# Altium schematic sheet Группа 2.SchDoc
size 420 x 297 mm
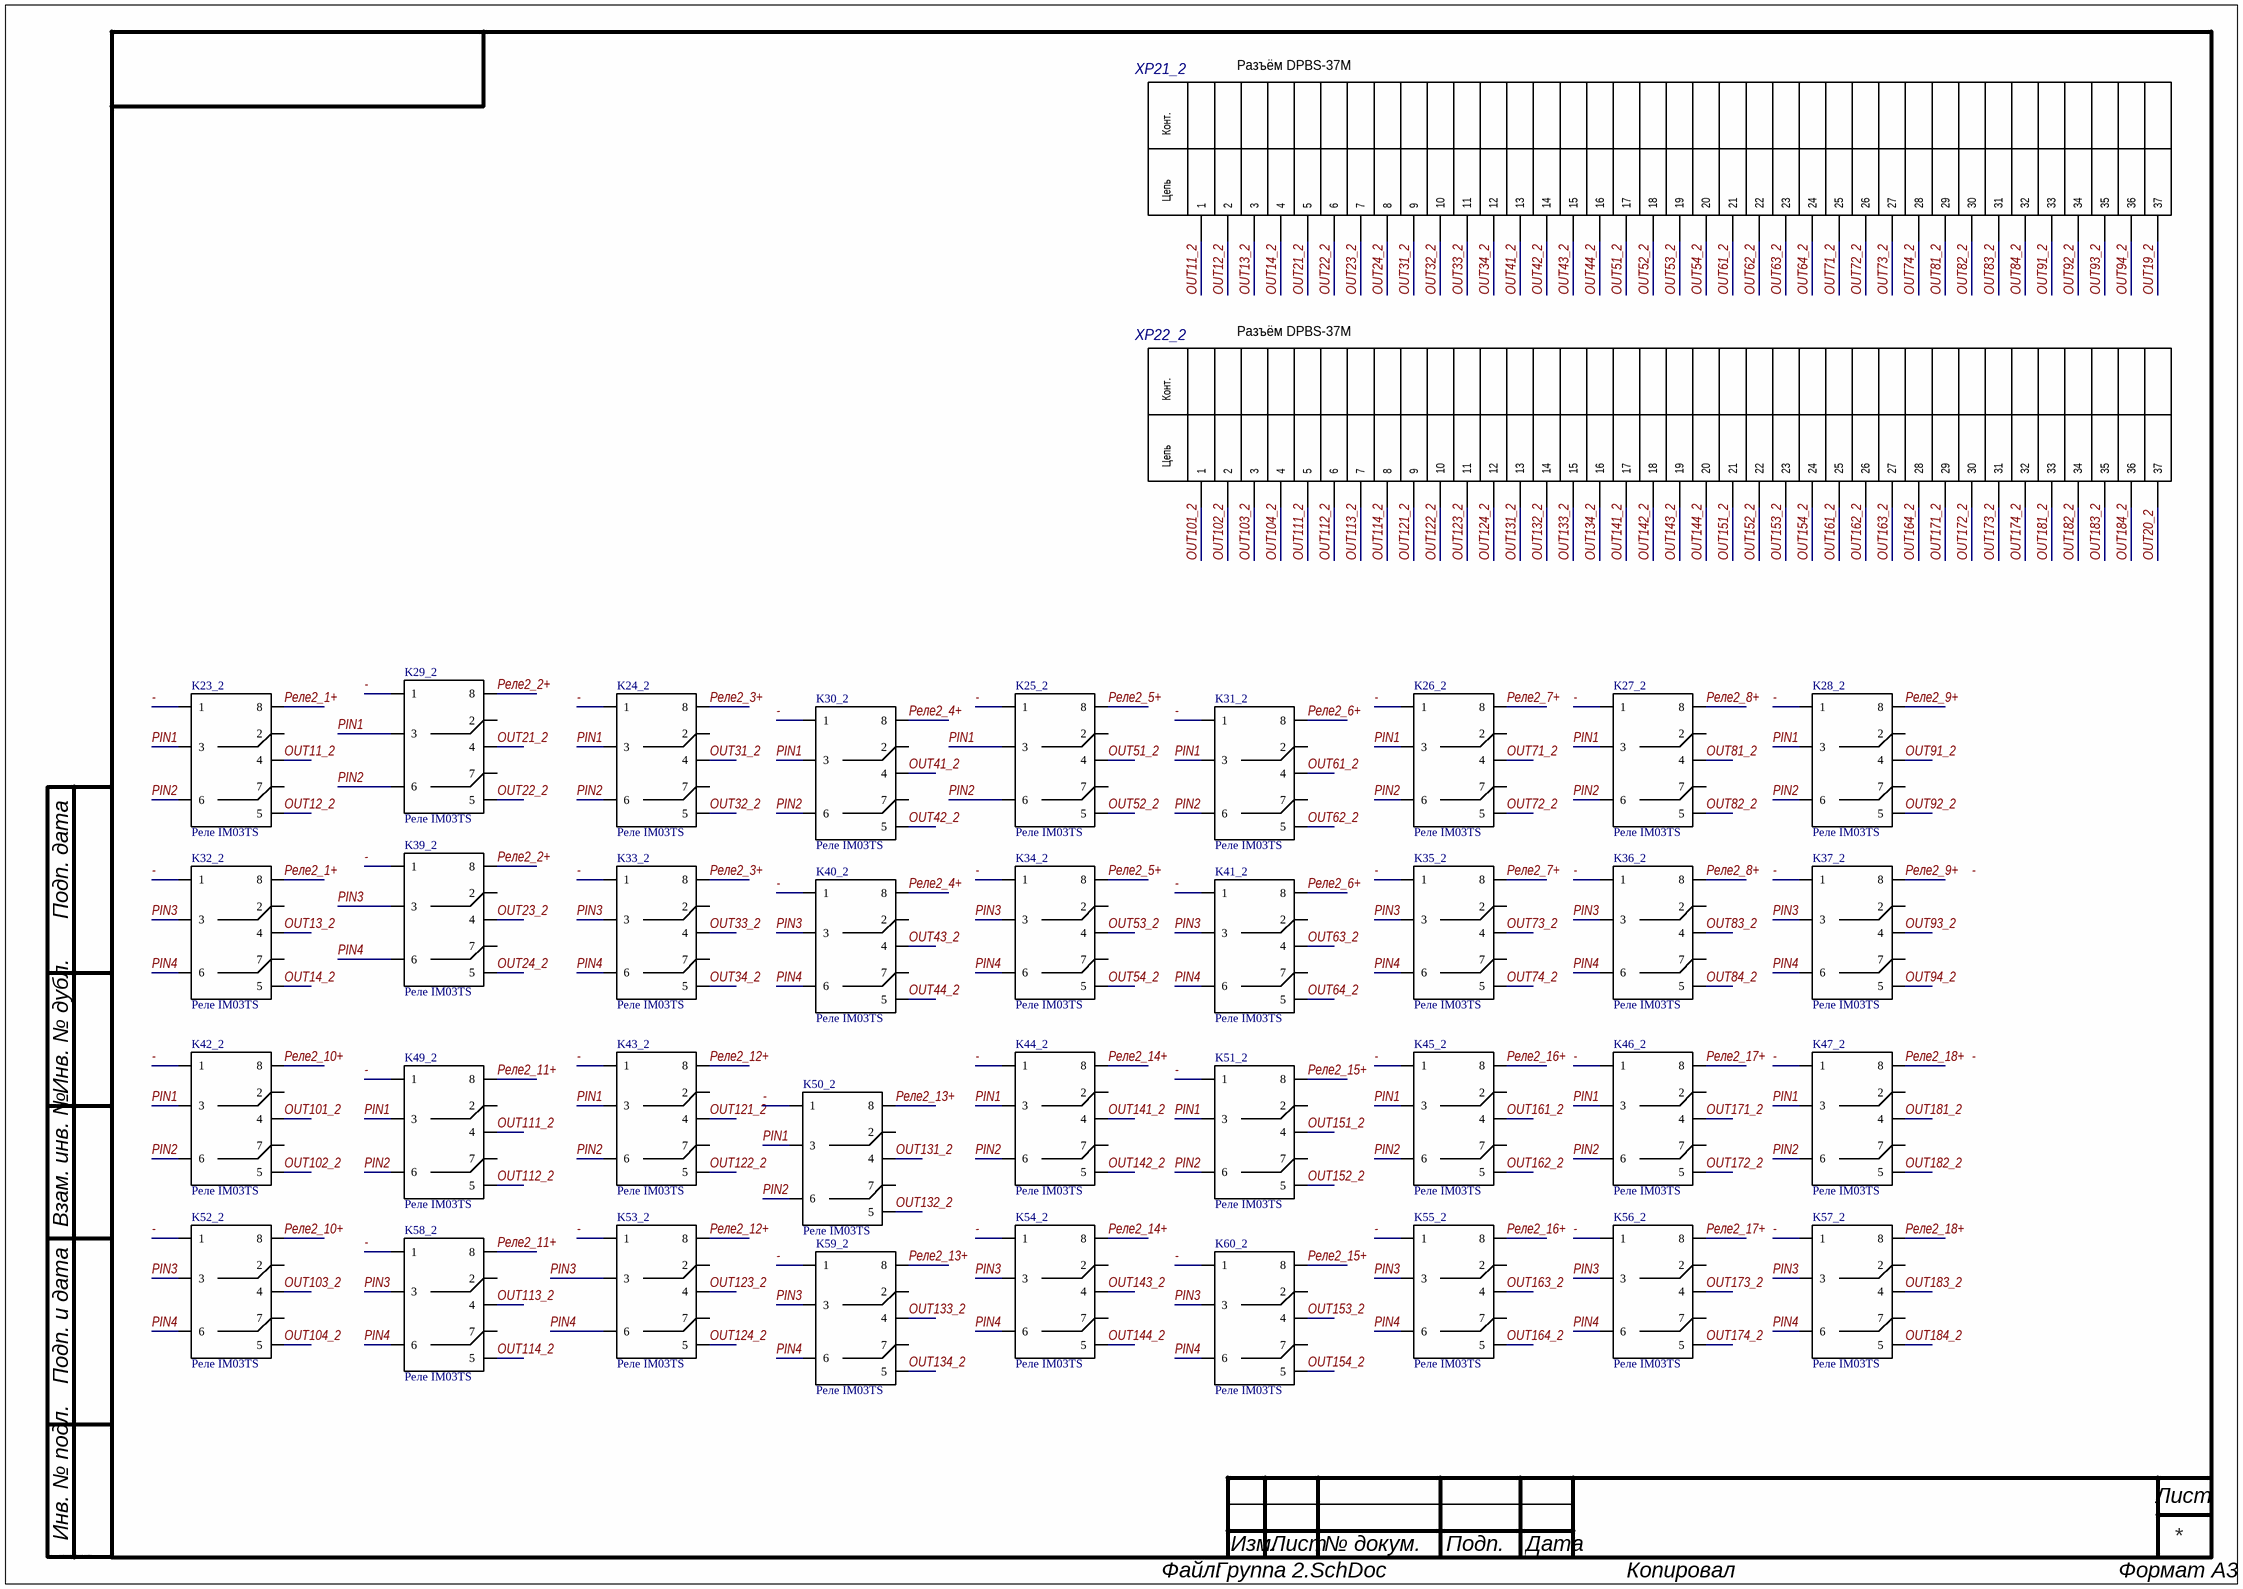
[diagram p0: Группа 2.SchDoc]

## Parts
K23_2  Реле IM03TS  [IM03TS]
K24_2  Реле IM03TS  [IM03TS]
K25_2  Реле IM03TS  [IM03TS]
K26_2  Реле IM03TS  [IM03TS]
K27_2  Реле IM03TS  [IM03TS]
K28_2  Реле IM03TS  [IM03TS]
K29_2  Реле IM03TS  [IM03TS]
K30_2  Реле IM03TS  [IM03TS]
K31_2  Реле IM03TS  [IM03TS]
K32_2  Реле IM03TS  [IM03TS]
K33_2  Реле IM03TS  [IM03TS]
K34_2  Реле IM03TS  [IM03TS]
K35_2  Реле IM03TS  [IM03TS]
K36_2  Реле IM03TS  [IM03TS]
K37_2  Реле IM03TS  [IM03TS]
K39_2  Реле IM03TS  [IM03TS]
K40_2  Реле IM03TS  [IM03TS]
K41_2  Реле IM03TS  [IM03TS]
K42_2  Реле IM03TS  [IM03TS]
K43_2  Реле IM03TS  [IM03TS]
K44_2  Реле IM03TS  [IM03TS]
K45_2  Реле IM03TS  [IM03TS]
K46_2  Реле IM03TS  [IM03TS]
K47_2  Реле IM03TS  [IM03TS]
K49_2  Реле IM03TS  [IM03TS]
K50_2  Реле IM03TS  [IM03TS]
K51_2  Реле IM03TS  [IM03TS]
K52_2  Реле IM03TS  [IM03TS]
K53_2  Реле IM03TS  [IM03TS]
K54_2  Реле IM03TS  [IM03TS]
K55_2  Реле IM03TS  [IM03TS]
K56_2  Реле IM03TS  [IM03TS]
K57_2  Реле IM03TS  [IM03TS]
K58_2  Реле IM03TS  [IM03TS]
K59_2  Реле IM03TS  [IM03TS]
K60_2  Реле IM03TS  [IM03TS]
XP21_2  Разъём DPBS-37M  [DPBS-37M]
XP22_2  Разъём DPBS-37M  [DPBS-37M]

## Nets
-: K23_2.1 K24_2.1 K25_2.1 K26_2.1 K27_2.1 K28_2.1 K29_2.1 K30_2.1 K31_2.1 K32_2.1 K33_2.1 K34_2.1 K35_2.1 K36_2.1 K37_2.1 K39_2.1 K40_2.1 K41_2.1 K42_2.1 K43_2.1 K44_2.1 K45_2.1 K46_2.1 K47_2.1 K49_2.1 K50_2.1 K51_2.1 K52_2.1 K53_2.1 K54_2.1 K55_2.1 K56_2.1 K57_2.1 K58_2.1 K59_2.1 K60_2.1
OUT11_2: K23_2.4 XP21_2.1
OUT12_2: K23_2.5 XP21_2.2
OUT13_2: K32_2.4 XP21_2.3
OUT14_2: K32_2.5 XP21_2.4
OUT19_2: XP21_2.37
OUT20_2: XP22_2.37
OUT21_2: K29_2.4 XP21_2.5
OUT22_2: K29_2.5 XP21_2.6
OUT23_2: K39_2.4 XP21_2.7
OUT24_2: K39_2.5 XP21_2.8
OUT31_2: K24_2.4 XP21_2.9
OUT32_2: K24_2.5 XP21_2.10
OUT33_2: K33_2.4 XP21_2.11
OUT34_2: K33_2.5 XP21_2.12
OUT41_2: K30_2.4 XP21_2.13
OUT42_2: K30_2.5 XP21_2.14
OUT43_2: K40_2.4 XP21_2.15
OUT44_2: K40_2.5 XP21_2.16
OUT51_2: K25_2.4 XP21_2.17
OUT52_2: K25_2.5 XP21_2.18
OUT53_2: K34_2.4 XP21_2.19
OUT54_2: K34_2.5 XP21_2.20
OUT61_2: K31_2.4 XP21_2.21
OUT62_2: K31_2.5 XP21_2.22
OUT63_2: K41_2.4 XP21_2.23
OUT64_2: K41_2.5 XP21_2.24
OUT71_2: K26_2.4 XP21_2.25
OUT72_2: K26_2.5 XP21_2.26
OUT73_2: K35_2.4 XP21_2.27
OUT74_2: K35_2.5 XP21_2.28
OUT81_2: K27_2.4 XP21_2.29
OUT82_2: K27_2.5 XP21_2.30
OUT83_2: K36_2.4 XP21_2.31
OUT84_2: K36_2.5 XP21_2.32
OUT91_2: K28_2.4 XP21_2.33
OUT92_2: K28_2.5 XP21_2.34
OUT93_2: K37_2.4 XP21_2.35
OUT94_2: K37_2.5 XP21_2.36
OUT101_2: K42_2.4 XP22_2.1
OUT102_2: K42_2.5 XP22_2.2
OUT103_2: K52_2.4 XP22_2.3
OUT104_2: K52_2.5 XP22_2.4
OUT111_2: K49_2.4 XP22_2.5
OUT112_2: K49_2.5 XP22_2.6
OUT113_2: K58_2.4 XP22_2.7
OUT114_2: K58_2.5 XP22_2.8
OUT121_2: K43_2.4 XP22_2.9
OUT122_2: K43_2.5 XP22_2.10
OUT123_2: K53_2.4 XP22_2.11
OUT124_2: K53_2.5 XP22_2.12
OUT131_2: K50_2.4 XP22_2.13
OUT132_2: K50_2.5 XP22_2.14
OUT133_2: K59_2.4 XP22_2.15
OUT134_2: K59_2.5 XP22_2.16
OUT141_2: K44_2.4 XP22_2.17
OUT142_2: K44_2.5 XP22_2.18
OUT143_2: K54_2.4 XP22_2.19
OUT144_2: K54_2.5 XP22_2.20
OUT151_2: K51_2.4 XP22_2.21
OUT152_2: K51_2.5 XP22_2.22
OUT153_2: K60_2.4 XP22_2.23
OUT154_2: K60_2.5 XP22_2.24
OUT161_2: K45_2.4 XP22_2.25
OUT162_2: K45_2.5 XP22_2.26
OUT163_2: K55_2.4 XP22_2.27
OUT164_2: K55_2.5 XP22_2.28
OUT171_2: K46_2.4 XP22_2.29
OUT172_2: K46_2.5 XP22_2.30
OUT173_2: K56_2.4 XP22_2.31
OUT174_2: K56_2.5 XP22_2.32
OUT181_2: K47_2.4 XP22_2.33
OUT182_2: K47_2.5 XP22_2.34
OUT183_2: K57_2.4 XP22_2.35
OUT184_2: K57_2.5 XP22_2.36
PIN1: K23_2.3 K24_2.3 K25_2.3 K26_2.3 K27_2.3 K28_2.3 K29_2.3 K30_2.3 K31_2.3 K42_2.3 K43_2.3 K44_2.3 K45_2.3 K46_2.3 K47_2.3 K49_2.3 K50_2.3 K51_2.3
PIN2: K23_2.6 K24_2.6 K25_2.6 K26_2.6 K27_2.6 K28_2.6 K29_2.6 K30_2.6 K31_2.6 K42_2.6 K43_2.6 K44_2.6 K45_2.6 K46_2.6 K47_2.6 K49_2.6 K50_2.6 K51_2.6
PIN3: K32_2.3 K33_2.3 K34_2.3 K35_2.3 K36_2.3 K37_2.3 K39_2.3 K40_2.3 K41_2.3 K52_2.3 K53_2.3 K54_2.3 K55_2.3 K56_2.3 K57_2.3 K58_2.3 K59_2.3 K60_2.3
PIN4: K32_2.6 K33_2.6 K34_2.6 K35_2.6 K36_2.6 K37_2.6 K39_2.6 K40_2.6 K41_2.6 K52_2.6 K53_2.6 K54_2.6 K55_2.6 K56_2.6 K57_2.6 K58_2.6 K59_2.6 K60_2.6
Реле2_1+: K23_2.8 K32_2.8
Реле2_2+: K29_2.8 K39_2.8
Реле2_3+: K24_2.8 K33_2.8
Реле2_4+: K30_2.8 K40_2.8
Реле2_5+: K25_2.8 K34_2.8
Реле2_6+: K31_2.8 K41_2.8
Реле2_7+: K26_2.8 K35_2.8
Реле2_8+: K27_2.8 K36_2.8
Реле2_9+: K28_2.8 K37_2.8
Реле2_10+: K42_2.8 K52_2.8
Реле2_11+: K49_2.8 K58_2.8
Реле2_12+: K43_2.8 K53_2.8
Реле2_13+: K50_2.8 K59_2.8
Реле2_14+: K44_2.8 K54_2.8
Реле2_15+: K51_2.8 K60_2.8
Реле2_16+: K45_2.8 K55_2.8
Реле2_17+: K46_2.8 K56_2.8
Реле2_18+: K47_2.8 K57_2.8

Not connected (* = marked no-connect by the designer): K23_2 2 7; K24_2 2 7; K25_2 2 7; K26_2 2 7; K27_2 2 7; K28_2 2 7; K29_2 2 7; K30_2 2 7; K31_2 2 7; K32_2 2 7; K33_2 2 7; K34_2 2 7; K35_2 2 7; K36_2 2 7; K37_2 2 7; K39_2 2 7; K40_2 2 7; K41_2 2 7; K42_2 2 7; K43_2 2 7; K44_2 2 7; K45_2 2 7; K46_2 2 7; K47_2 2 7; K49_2 2 7; K50_2 2 7; K51_2 2 7; K52_2 2 7; K53_2 2 7; K54_2 2 7; K55_2 2 7; K56_2 2 7; K57_2 2 7; K58_2 2 7; K59_2 2 7; K60_2 2 7

## Notes on the sheet
- Labels drawn without touching a wire or pin: -
- Подп. дата
- Инв. № дубл.
- Взам. инв. №
- Подп. и дата
- Инв. № подл.
- Изм.
- Лист
- № докум.
- Подп.
- Дата
- ALTIUM GOSTBOM2.0 KEV
- Файл:
- Копировал
- Формат А3
- (in symbol DPBS-37M) Конт.; Цепь

## Library data of the parts
K23_2 K24_2 K25_2 K26_2 K27_2 K28_2 K29_2 K30_2 K31_2 K32_2 K33_2 K34_2 K35_2 K36_2 K37_2 K39_2 K40_2 K41_2 K42_2 K43_2 K44_2 K45_2 K46_2 K47_2 K49_2 K50_2 K51_2 K52_2 K53_2 K54_2 K55_2 K56_2 K57_2 K58_2 K59_2 K60_2 = IM03TS: Реле
XP21_2 XP22_2 = DPBS-37M